# EasyEDA Pro project ProProject_GuudBox.epro

# Schematic Schematic1
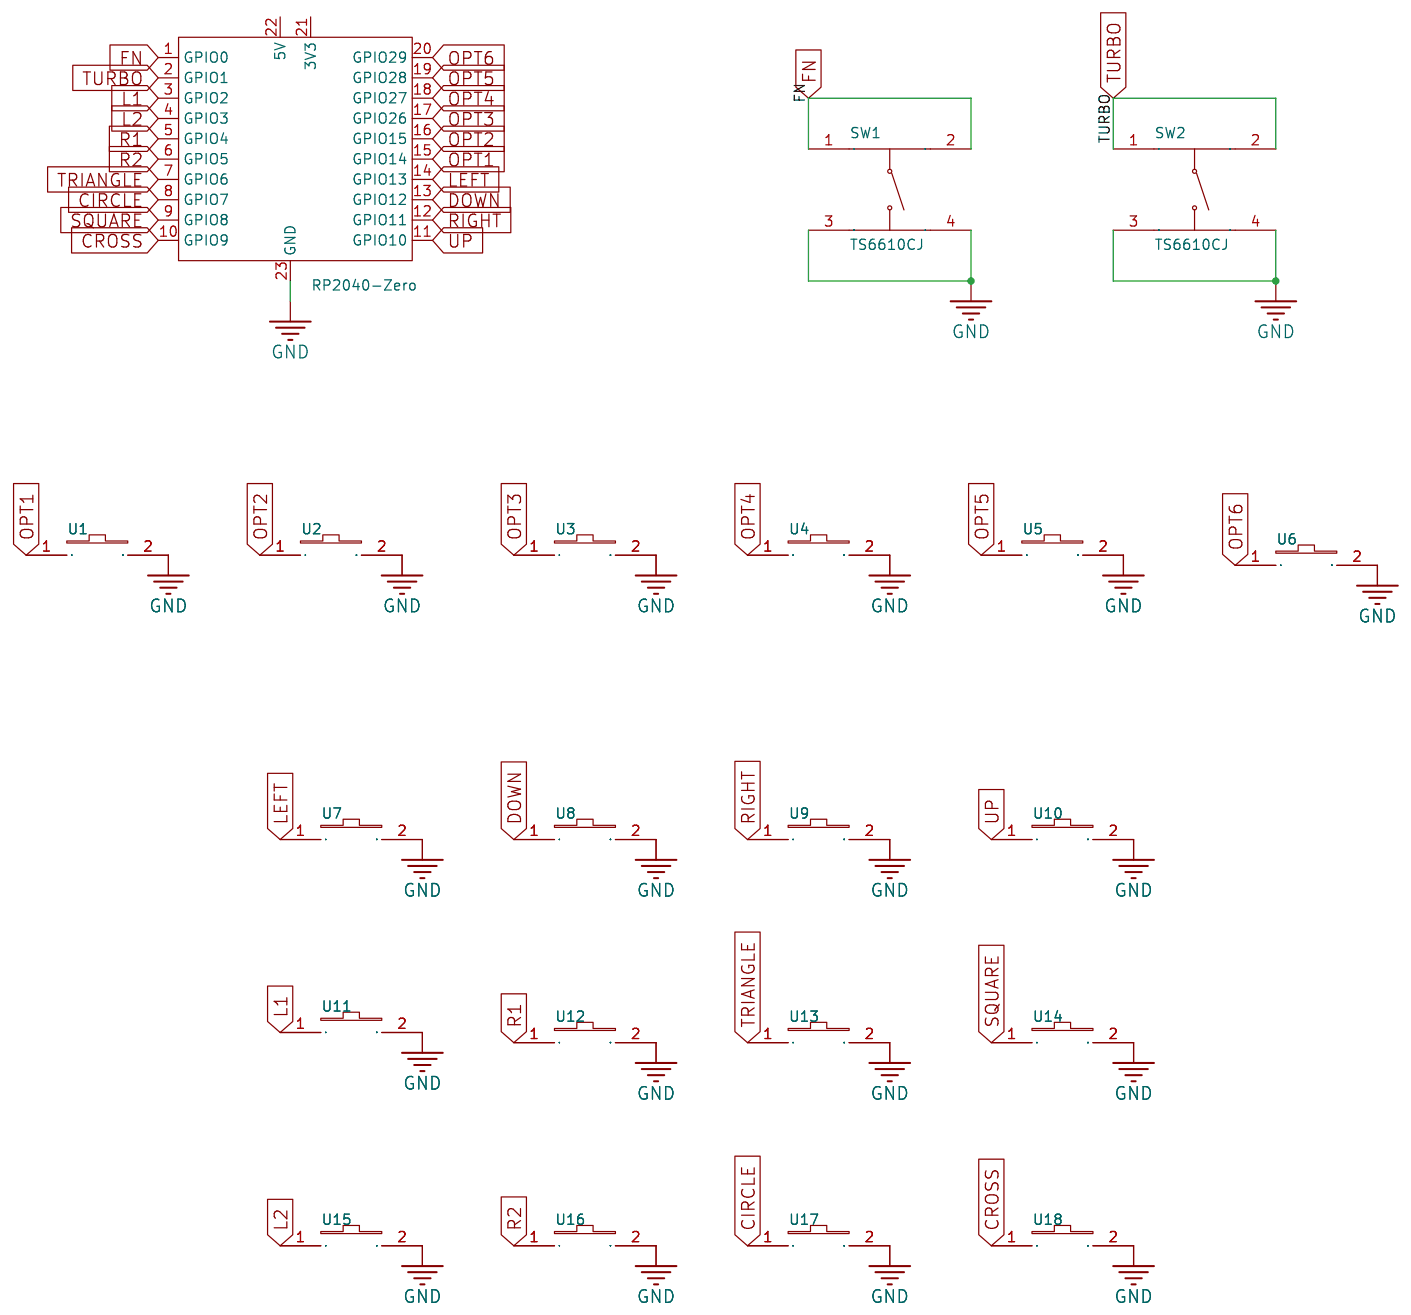
[diagram p0: schematic sheet]

## Parts
RP2040-Zero  RP2040-Zero  [WaveShare RP2040-Zero near_edge_bottom_side]
SW1  TS6610CJ  [SW-TH_4P-L6.0-W6.0-P4.50-LS6.5]
SW2  TS6610CJ  [SW-TH_4P-L6.0-W6.0-P4.50-LS6.5]
U1  -  [GATERON low profile hot-swap flip_routing]
U2  -  [GATERON low profile hot-swap flip_routing]
U3  -  [GATERON low profile hot-swap flip_routing]
U4  -  [GATERON low profile hot-swap flip_routing]
U5  -  [GATERON low profile hot-swap flip_routing]
U6  -  [GATERON low profile hot-swap flip_routing]
U7  -  [GATERON low profile hot-swap flip_routing]
U8  -  [GATERON low profile hot-swap flip_routing]
U9  -  [GATERON low profile hot-swap flip_routing]
U10  -  [GATERON low profile hot-swap flip_routing]
U11  -  [GATERON low profile hot-swap flip_routing]
U12  -  [GATERON low profile hot-swap flip_routing]
U13  -  [GATERON low profile hot-swap flip_routing]
U14  -  [GATERON low profile hot-swap flip_routing]
U15  -  [GATERON low profile hot-swap flip_routing]
U16  -  [GATERON low profile hot-swap flip_routing]
U17  -  [GATERON low profile hot-swap flip_routing]
U18  -  [GATERON low profile hot-swap flip_routing]

## Library data of the parts
RP2040-Zero = WaveShare RP2040-Zero near_edge_bottom_side
SW1 SW2 = TS6610CJ: 触点电流:50mA;额定电压(DC):12V;绝缘电阻:100MΩ;电路结构:单刀单掷;安装方式:直插;作用力:250gf@±30gf;机械寿命:8万次;带支架:否;; LCSC Part Name: 6*6*10mm 直插 轻触开关; Supplier Part: C557627; Manufacturer: SHOU HAN(首韩); Supplier Footprint: 插件; JLCPCB Part Class: Extended Part; Datasheet: https://atta.szlcsc.com/upload/public/pdf/source/20200519/C557627_67A7C08B820682292738C3156CAB52AC.pdf; Supplier: LCSC; Contact Current: 50mA; Voltage Rating (DC): 12V; Insulation Resistance: 100MΩ; Circuit: 单刀单掷; Mounting Style: 直插; Actuator Style: 圆形按钮; Actuator/Cap Color: 黑色; Operating Force: 250gf@±30gf; Mechanical Life: 8万次; Operating Temperature: -20℃~+85℃; Pin Style: PC引脚; Switch Length: 6mm; Switch Width: 6mm; Switch Height: 10mm; Strike Gundam: 否
U1-U18 = GATERON low profile hot-swap

## Nets
GND: RP2040-Zero.23(GND) SW1.3(C) SW1.4(D) SW2.3(C) SW2.4(D) U1.2 U2.2 U3.2 U4.2 U5.2 U6.2 U7.2 U8.2 U9.2 U10.2 U11.2 U12.2 U13.2 U14.2 U15.2 U16.2 U17.2 U18.2
CIRCLE: RP2040-Zero.8(GPIO7) U17.1
CROSS: RP2040-Zero.10(GPIO9) U18.1
DOWN: RP2040-Zero.13(GPIO12) U8.1
FN: RP2040-Zero.1(GPIO0) SW1.1(A) SW1.2(B)
L1: RP2040-Zero.3(GPIO2) U11.1
L2: RP2040-Zero.4(GPIO3) U15.1
LEFT: RP2040-Zero.14(GPIO13) U7.1
OPT1: RP2040-Zero.15(GPIO14) U1.1
OPT2: RP2040-Zero.16(GPIO15) U2.1
OPT3: RP2040-Zero.17(GPIO26) U3.1
OPT4: RP2040-Zero.18(GPIO27) U4.1
OPT5: RP2040-Zero.19(GPIO28) U5.1
OPT6: RP2040-Zero.20(GPIO29) U6.1
R1: RP2040-Zero.5(GPIO4) U12.1
R2: RP2040-Zero.6(GPIO5) U16.1
RIGHT: RP2040-Zero.12(GPIO11) U9.1
SQUARE: RP2040-Zero.9(GPIO8) U14.1
TRIANGLE: RP2040-Zero.7(GPIO6) U13.1
TURBO: RP2040-Zero.2(GPIO1) SW2.1(A) SW2.2(B)
UP: RP2040-Zero.11(GPIO10) U10.1

Not connected (* = marked no-connect by the designer): RP2040-Zero 21(3V3) 22(5V)

# Board PCB1
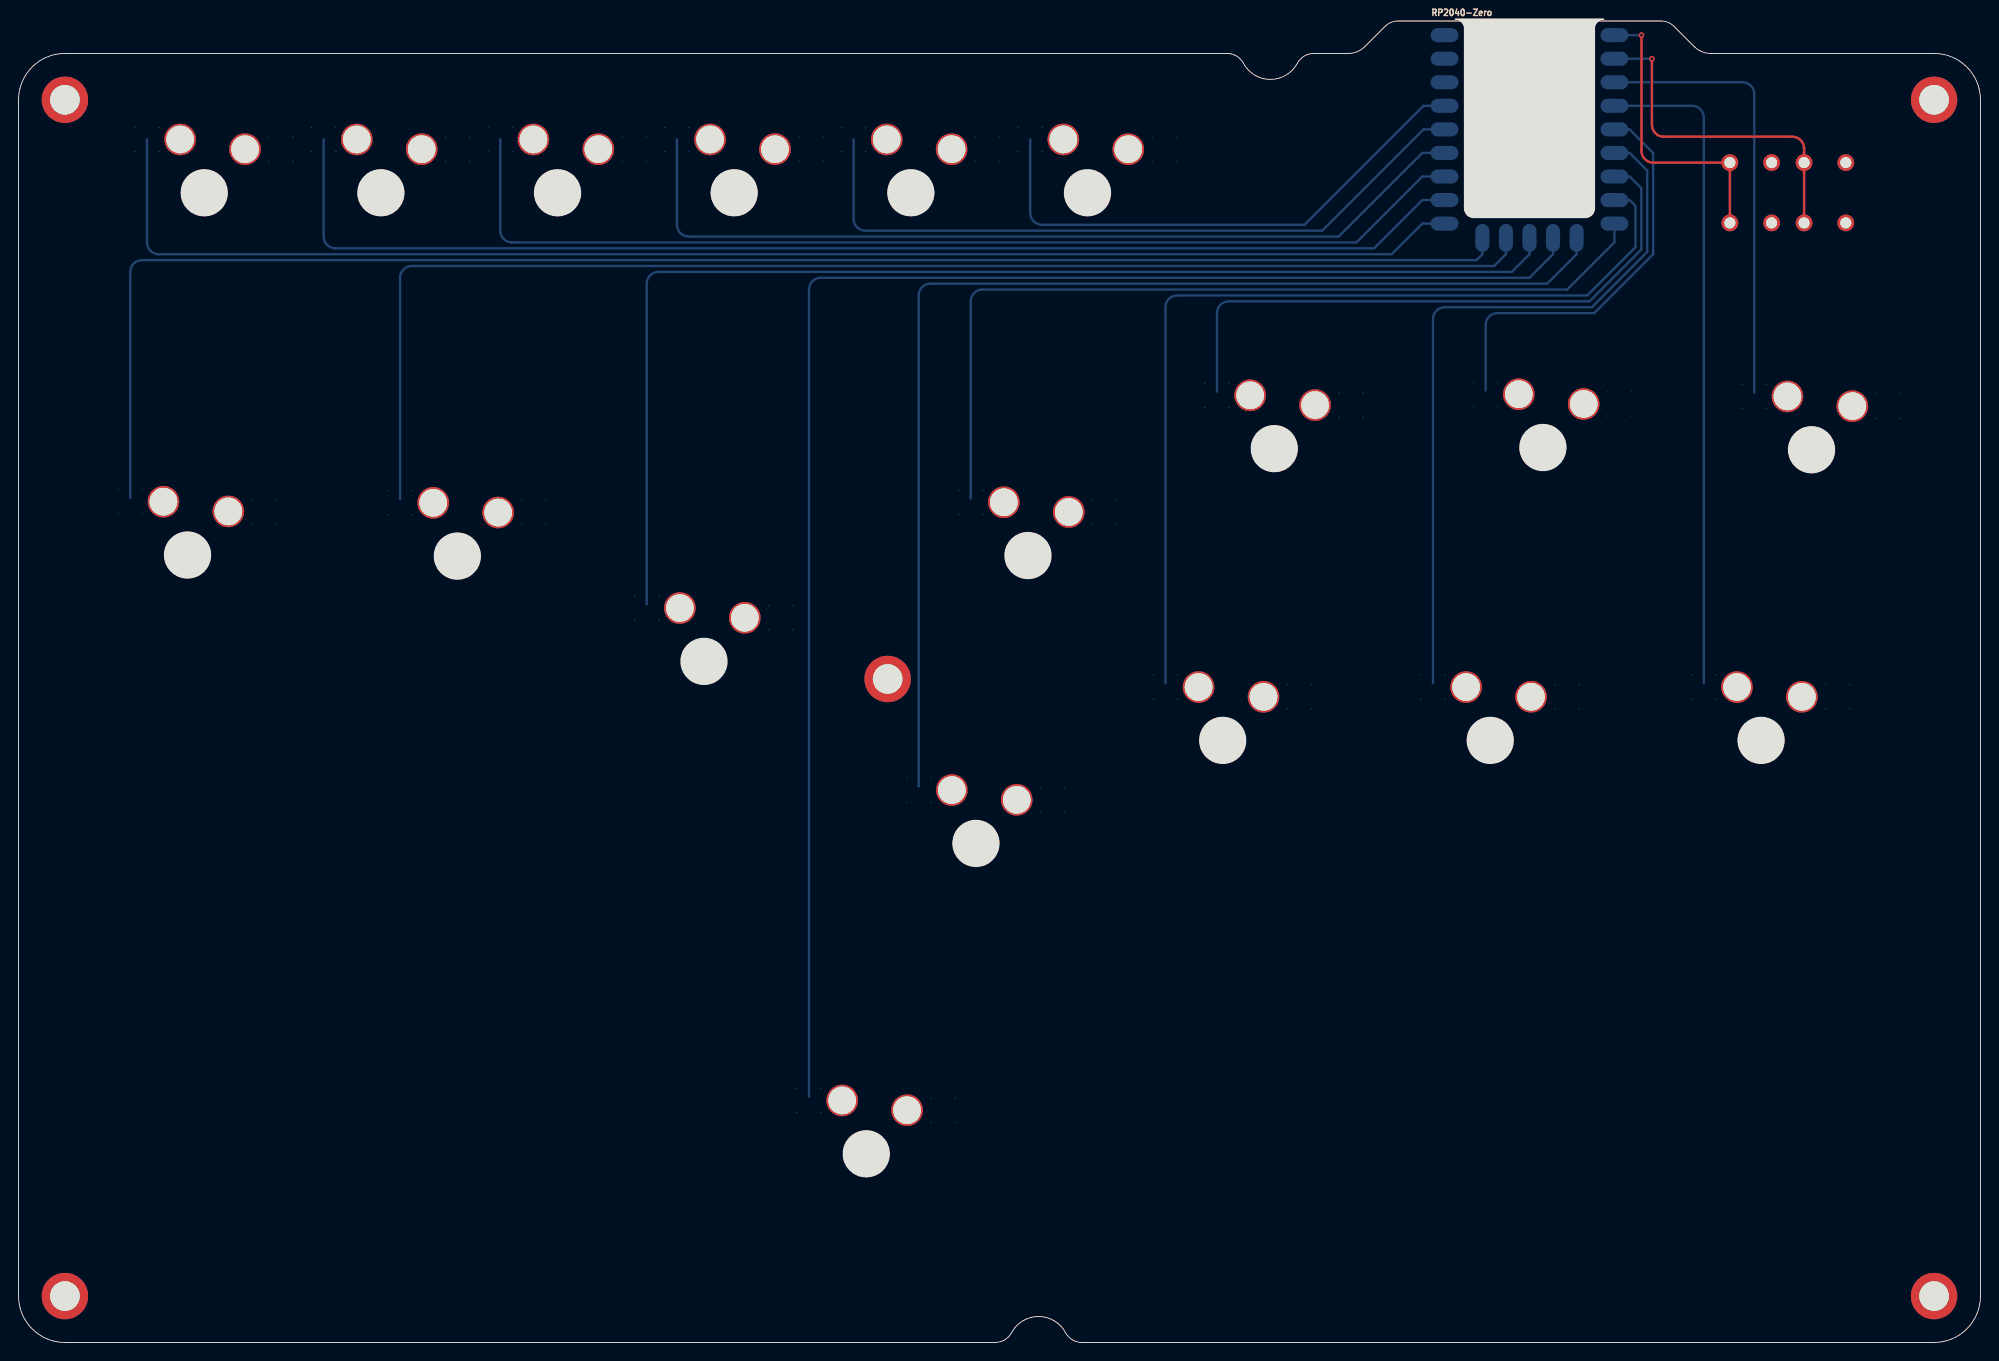
[diagram p1: board, top side]
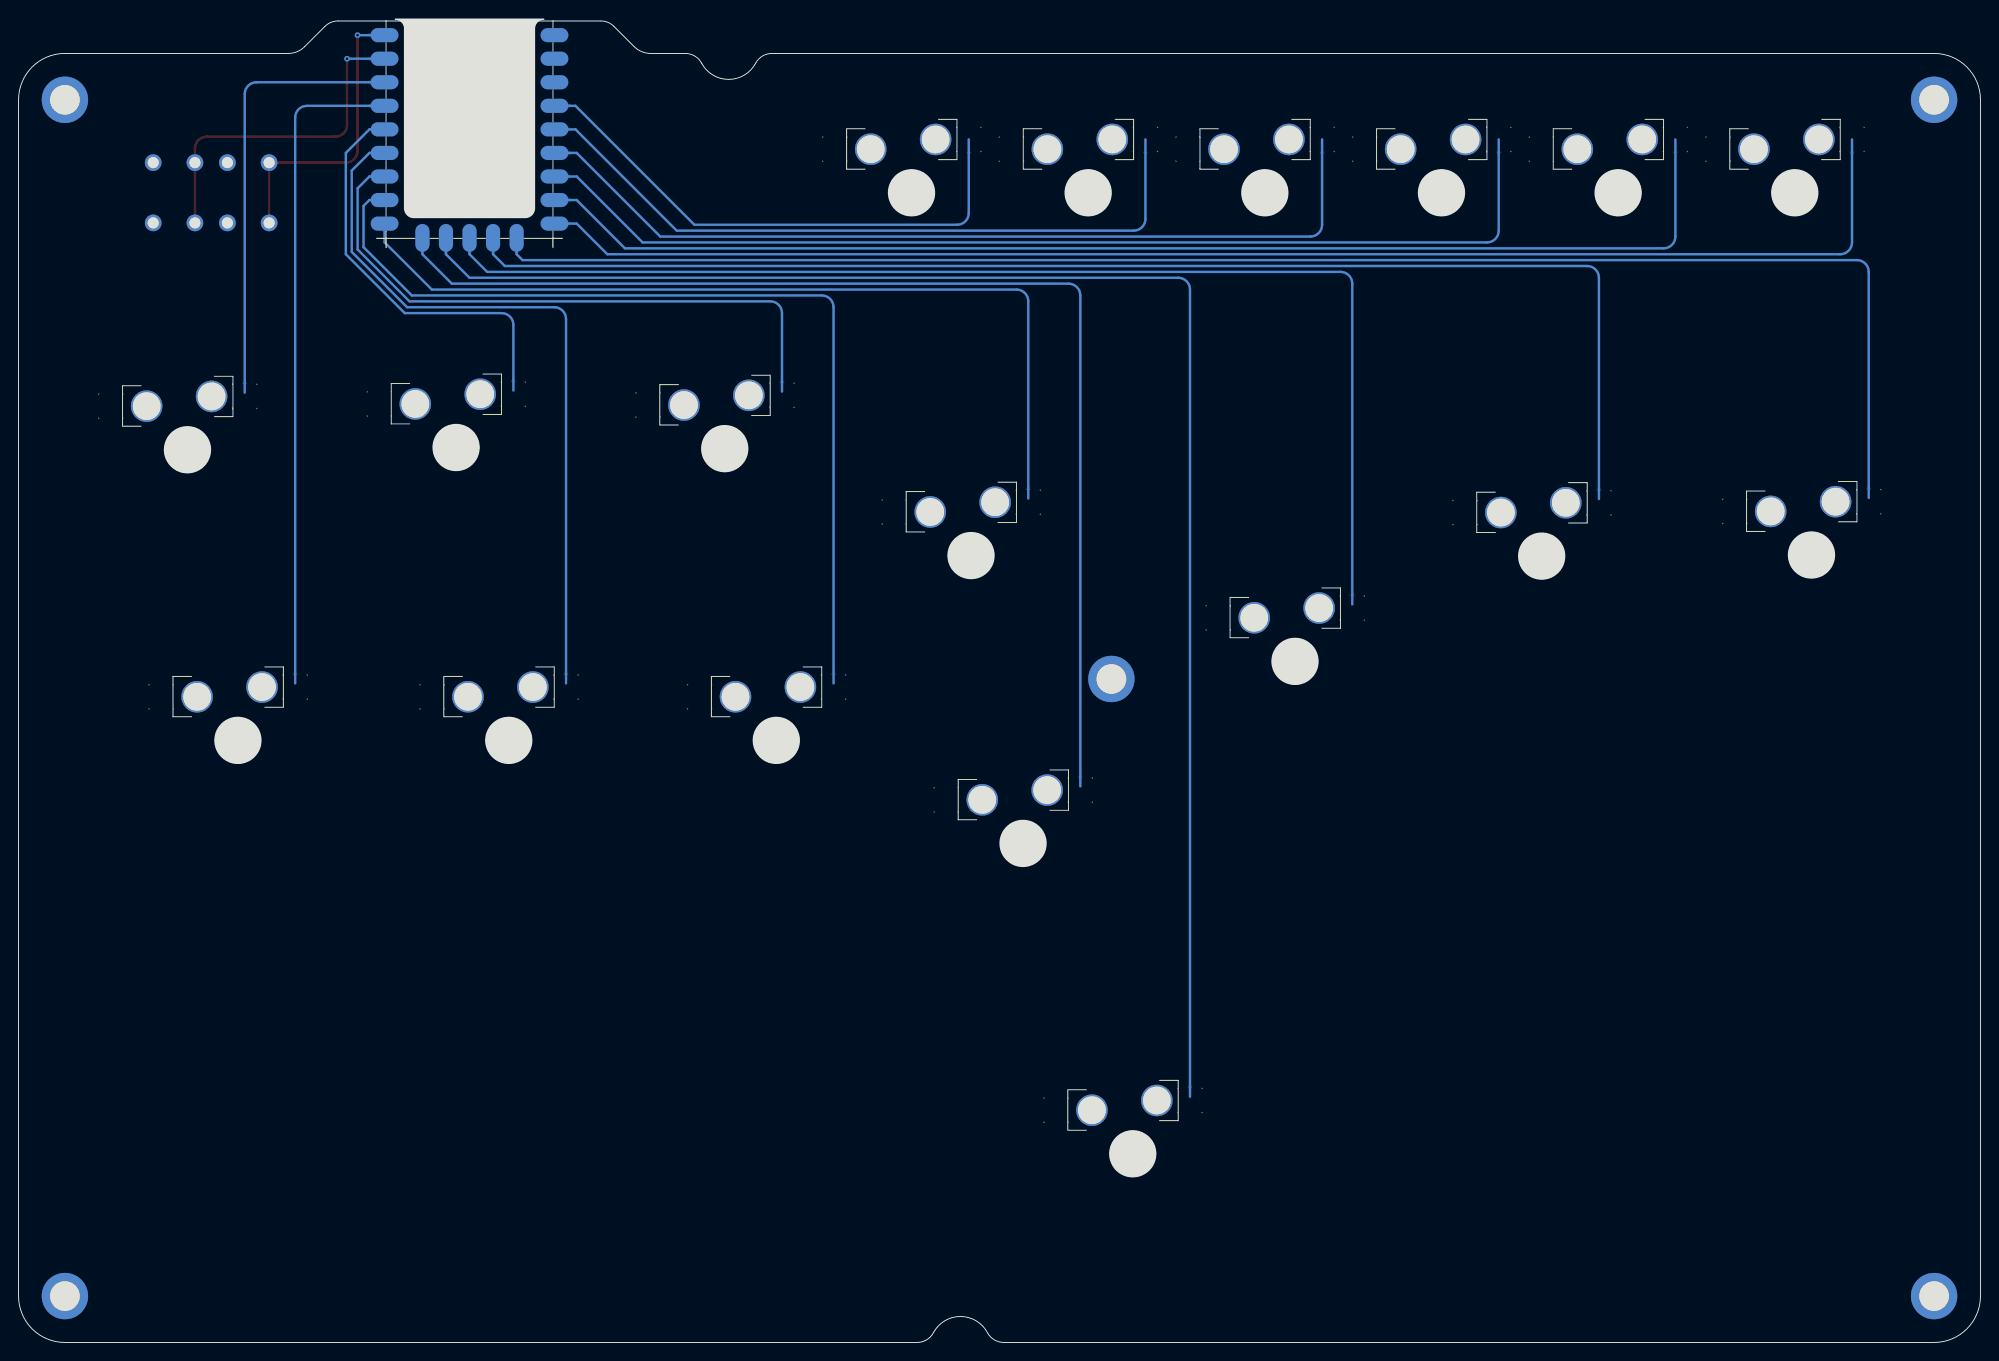
[diagram p2: board, bottom side, seen from below]

Outline 211.57 x 142.76 mm; copper layers: Top Layer, Bottom Layer. Coordinates in mm from the lower left corner of the outline.
Outline path: 0,134 arc(1.46,137.54) 5,139 130.33,139 arc(131.35,138.72) 132.09,137.94 arc(135,136.2) 137.91,137.94 arc(138.65,138.72) 139.67,139 143.41,139 arc(144.37,139.19) 145.18,139.73 147.36,141.91 arc(148.01,142.35) 148.78,142.5 177.12,142.5 arc(177.89,142.35) 178.54,141.91 180.72,139.73 arc(181.53,139.19) 182.49,139 206.57,139 arc(210.11,137.54) 211.57,134 211.57,5 arc(210.11,1.46) 206.57,0 114.67,0 arc(113.65,0.28) 112.91,1.06 arc(110,2.8) 107.09,1.06 arc(106.35,0.28) 105.33,0 5,0 arc(1.46,1.46) 0,5 0,134
Stack: Top Layer 0.035mm / Dielectric1 1.51mm FR4 er 4.5 / Bottom Layer 0.035mm

## Design rules (mm)
template: JLCPCB Capability(Two Layers Board)
spacing copperThickness1oz (default): track to track 0.102, other pairs 0.152 to 0.3
spacing copperThickness2oz: track to track 0.203, other pairs 0.152 to 0.3
track width copperThickness1oz (default): min 0.127, default 0.254, max 2.54
track width copperThickness2oz: min 0.203, default 0.254, max 2.54
differential pair differentialPair (default): width min 0.127, default 0.254, max 2.54; gap min 0.152, default 0.152
via viaSize (default): diameter min 0.5, default 0.61, max 10; hole min 0.3, default 0.305, max 6.3

## Placement (name value [footprint] x y rotation side)
NOREF  -  [Pad_e867]  206.57 5 0 top
NOREF#2  -  [Pad_e861]  5 134 0 top
NOREF#3  -  [Pad_e948]  93.72 71.54 0 top
NOREF#4  -  [Pad_e865]  5 5 0 top
NOREF#5  -  [Pad_e866]  206.57 134 0 top
RP2040-Zero  RP2040-Zero  [WaveShare RP2040-Zero near_edge_bottom_side]  162.94 130.81 0 top
SW1  TS6610CJ  [SW-TH_4P-L6.0-W6.0-P4.50-LS6.5]  186.8 123.97 90 top
SW2  TS6610CJ  [SW-TH_4P-L6.0-W6.0-P4.50-LS6.5]  194.8 123.97 90 top
U1  -  [GATERON low profile hot-swap flip_routing]  20.02 123.97 0 top
U2  -  [GATERON low profile hot-swap flip_routing]  39.08 123.97 0 top
U3  -  [GATERON low profile hot-swap flip_routing]  58.12 123.97 0 top
U4  -  [GATERON low profile hot-swap flip_routing]  77.17 123.97 0 top
U5  -  [GATERON low profile hot-swap flip_routing]  96.22 123.97 0 top
U6  -  [GATERON low profile hot-swap flip_routing]  115.28 123.97 0 top
U7  -  [GATERON low profile hot-swap flip_routing]  18.22 84.91 0 top
U8  -  [GATERON low profile hot-swap flip_routing]  47.32 84.79 0 top
U9  -  [GATERON low profile hot-swap flip_routing]  73.92 73.44 0 top
U10  -  [GATERON low profile hot-swap flip_routing]  91.42 20.34 0 top
U11  -  [GATERON low profile hot-swap flip_routing]  193.36 96.26 0 top
U12  -  [GATERON low profile hot-swap flip_routing]  164.39 96.5 0 top
U13  -  [GATERON low profile hot-swap flip_routing]  135.42 96.38 0 top
U14  -  [GATERON low profile hot-swap flip_routing]  108.86 84.85 0 top
U15  -  [GATERON low profile hot-swap flip_routing]  187.92 64.92 0 top
U16  -  [GATERON low profile hot-swap flip_routing]  158.71 64.92 0 top
U17  -  [GATERON low profile hot-swap flip_routing]  129.86 64.92 0 top
U18  -  [GATERON low profile hot-swap flip_routing]  103.25 53.81 0 top

## Footprints (pads in the part's own frame, mm; a bottom-side part is the same pattern mirrored in y, then rotated)
GATERON low profile hot-swap flip_routing
  custom 2.65x2.65 smd far side: 1(-6.175,5.75) 2(8.275,4.7)
  round 3.4 hole 3: 3(-2.6,5.75) 4(4.4,4.7)
Pad_e861
  round 5 hole 3.2: 24(0,0)
Pad_e865
  round 5 hole 3.2: 25(0,0)
Pad_e866
  round 5 hole 3.2: 26(0,0)
Pad_e867
  round 5 hole 3.2: 27(0,0)
Pad_e948
  round 5 hole 3.2: 28(0,0)
SW-TH_4P-L6.0-W6.0-P4.50-LS6.5
  round 1.8 hole 1.2: 1(-3.25,2.25) 2(3.25,2.25) 3(-3.25,-2.25) 4(3.25,-2.25)
WaveShare RP2040-Zero near_edge_bottom_side
  rrect 3x1.524 smd far side: 1(9.16,10.16) 2(9.16,7.62) 3(9.16,5.08) 4(9.16,2.54) 5(9.16,0) 6(9.16,-2.54) 7(9.16,-5.08) 8(9.16,-7.62) 9(9.16,-10.16) 15(-9.16,-10.16) 16(-9.16,-7.62) 17(-9.16,-5.08) 18(-9.16,-2.54) 19(-9.16,0) 20(-9.16,2.54) 21(-9.16,5.08) 22(-9.16,10.16) 23(-9.16,7.62)
  rrect 1.524x3 smd far side: 10(5.08,-11.7) 11(2.54,-11.7) 12(0,-11.7) 13(-2.54,-11.7) 14(-5.08,-11.7)

## Nets
As in the schematic.

Pads without a net: NOREF 27; NOREF#2 24; NOREF#3 28; NOREF#4 25; NOREF#5 26; RP2040-Zero 21 22; U1 3 4; U2 3 4; U3 3 4; U4 3 4; U5 3 4; U6 3 4; U7 3 4; U8 3 4; U9 3 4; U10 3 4; U11 3 4; U12 3 4; U13 3 4; U14 3 4; U15 3 4; U16 3 4; U17 3 4; U18 3 4

## Via types
v1: diameter 0.61, hole 0.305, Top Layer to Bottom Layer, 2 vias

## Routing (per net, layer and track width the routed paths; a pad name or vN(x,y) marks a point on that pad's centre or on a via; arc(x,y) is an arc through that point)
CIRCLE: length 101.1
  Bottom Layer w0.254: 124.95,112.9 arc(124.05,112.53) 123.68,111.63 123.68,71.08 ; 124.97,112.9 169.16,112.9 174.37,118.11 174.37,122.56 173.74,123.19 RP2040-Zero.8
CROSS: length 127.7
  Bottom Layer w0.254: 98.34,114.17 arc(97.45,113.8) 97.07,112.9 97.07,59.97 ; 168.02,119.11 168.02,117.35 164.85,114.17 98.3,114.17
DOWN: length 146.1
  Bottom Layer w0.254: 42.41,116.08 arc(41.51,115.71) 41.14,114.81 41.14,90.95 ; 42.42,116.08 159.13,116.08 160.4,117.35 RP2040-Zero.13
FN: length 32.1
  Top Layer w0.254: 176.29,127.22 arc(175.39,127.6) 175.02,128.49 ; 176.28,127.22 SW1.2 SW1.1 ; v1(175.02,140.97) 175.02,128.52
  Bottom Layer w0.254: RP2040-Zero.1 v1(175.02,140.97)
L1: length 48
  Bottom Layer w0.254: 185.91,135.89 arc(186.81,135.52) 187.18,134.62 187.18,102.42 ; RP2040-Zero.3 185.93,135.89
L2: length 71.4
  Bottom Layer w0.254: 180.47,133.35 arc(181.37,132.98) 181.74,132.08 181.74,71.08 ; RP2040-Zero.4 180.47,133.35
LEFT: length 172.9
  Bottom Layer w0.254: 12.05,115.44 arc(12.42,116.34) 13.32,116.71 ; 12.05,115.44 12.05,91.07 ; 13.34,116.71 157.23,116.71 157.86,117.35 RP2040-Zero.14
OPT1: length 153.1
  Bottom Layer w0.254: 15.12,117.35 arc(14.22,117.72) 13.85,118.62 U1.1 ; 15.11,117.35 148.08,117.35 151.38,120.65 RP2040-Zero.15
OPT2: length 134.2
  Bottom Layer w0.254: 34.17,117.98 arc(33.27,118.35) 32.9,119.25 U2.1 ; RP2040-Zero.16 151.38,123.19 146.18,117.98 34.16,117.98
OPT3: length 115.3
  Bottom Layer w0.254: 53.22,118.62 arc(52.32,118.99) 51.95,119.89 U3.1 ; 53.21,118.62 144.27,118.62 151.38,125.73 RP2040-Zero.17
OPT4: length 96.4
  Bottom Layer w0.254: 72.27,119.25 arc(71.37,119.62) 71,120.52 U4.1 ; RP2040-Zero.18 151.38,128.27 142.37,119.25 72.26,119.25
OPT5: length 77.6
  Bottom Layer w0.254: 91.32,119.89 arc(90.42,120.26) 90.05,121.16 U5.1 ; RP2040-Zero.19 151.51,130.81 140.59,119.89 91.31,119.89
OPT6: length 58.7
  Bottom Layer w0.254: 110.37,120.52 arc(109.47,120.89) 109.1,121.79 U6.1 ; RP2040-Zero.20 151.51,133.35 138.68,120.52 110.36,120.52
R1: length 44.6
  Bottom Layer w0.254: 159.48,111 arc(158.59,110.63) 158.21,109.73 158.21,102.66 ; 159.51,111 169.93,111 176.28,117.35 176.28,128.27 173.74,130.81 RP2040-Zero.5
R2: length 78.7
  Bottom Layer w0.254: 153.8,111.63 arc(152.91,111.26) 152.53,110.36 152.53,71.08 ; RP2040-Zero.6 173.74,128.27 175.64,126.37 175.64,117.6 169.67,111.63 153.8,111.63
RIGHT: length 133.1
  Bottom Layer w0.254: 69.01,115.44 arc(68.12,115.07) 67.74,114.17 67.74,79.6 ; RP2040-Zero.12 162.94,117.35 161.04,115.44 68.96,115.44
SQUARE: length 95.6
  Bottom Layer w0.254: 103.95,113.54 arc(103.06,113.17) 102.68,112.27 102.68,91.01 ; 103.89,113.54 167,113.54 172.1,118.63 RP2040-Zero.9
TRIANGLE: length 67.3
  Bottom Layer w0.254: 130.51,112.27 arc(129.61,111.9) 129.24,111 129.24,102.54 ; RP2040-Zero.7 173.74,125.73 175.01,124.46 175.01,117.86 169.42,112.27 130.56,112.27
TURBO: length 37.1
  Top Layer w0.254: 177.42,130.02 arc(176.52,130.39) 176.15,131.29 176.15,138.4 ; 192.55,128.75 arc(192.18,129.65) 191.28,130.02 177.42,130.02 ; 192.55,128.78 SW2.2 SW2.1
  Bottom Layer w0.254: v1(176.15,138.43) RP2040-Zero.2
UP: length 170.8
  Bottom Layer w0.254: 85.24,113.54 arc(85.61,114.44) 86.51,114.81 ; RP2040-Zero.11 165.48,117.35 162.94,114.81 86.49,114.81 ; 85.24,113.54 85.24,26.5

## Copper pours and planes (outline as drawn; the poured copper is in the pictures)
GND on Bottom Layer: 5,-0.05 1.43,1.43 -0.05,5 -0.05,134 1.43,137.57 5,139.05 130.33,139.05 131.38,138.76 132.13,137.97 133.33,136.71 135,136.25 136.67,136.71 137.87,137.97 138.62,138.76 139.67,139.05 143.41,139.05 144.35,139.24 145.15,139.77 147.33,141.95 147.99,142.39 148.78,142.55 177.12,142.55 177.91,142.39 178.57,141.95 180.75,139.77 181.55,139.24 182.49,139.05 206.57,139.05 210.15,137.57 211.62,134 211.62,5 210.15,1.43 206.57,-0.05 114.67,-0.05 113.62,0.24 112.87,1.03 111.67,2.29 110,2.75 108.33,2.29 107.13,1.03 106.38,0.24 105.33,-0.05

Small or netless copper shapes (teardrops, artwork), in the pictures only: 8 on Top Layer, 36 on Bottom Layer
